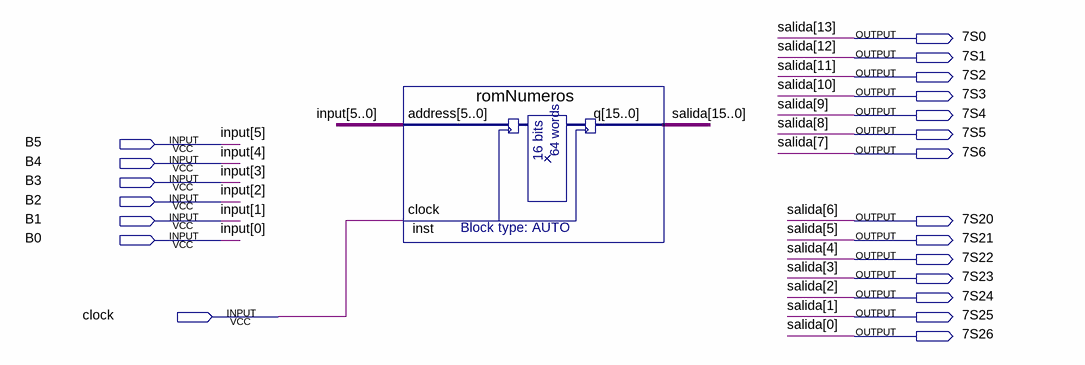
[diagram p0: schematic sheet]
// Quartus schematic 7seg6bits.bdf as structural Verilog: 1 symbols, 21 pins
module \7seg6bits  (
  input  B5,
  input  B4,
  input  B3,
  input  B2,
  input  B1,
  input  B0,
  input  clock,
  output \7S0 ,
  output \7S1 ,
  output \7S2 ,
  output \7S3 ,
  output \7S4 ,
  output \7S5 ,
  output \7S6 ,
  output \7S20 ,
  output \7S21 ,
  output \7S22 ,
  output \7S23 ,
  output \7S24 ,
  output \7S25 ,
  output \7S26 
);

  wire [15:14] salida;

  romNumeros inst (
    .address({B5, B4, B3, B2, B1, B0}), .clock(clock),
    .q({salida, \7S0 , \7S1 , \7S2 , \7S3 , \7S4 , \7S5 , \7S6 , \7S20 , \7S21 , \7S22 , \7S23 , \7S24 , \7S25 , \7S26 }));

  // Other names for the same wires on the sheet: input[5:0] = {B5, B4, B3, B2, B1, B0};
  //   salida[13:0] = {\7S0 , \7S1 , \7S2 , \7S3 , \7S4 , \7S5 , \7S6 , \7S20 , \7S21 , \7S22 , \7S23 , \7S24 , \7S25 , \7S26 }
endmodule
